# Altium schematic sheet MCU.SchDoc
size A4
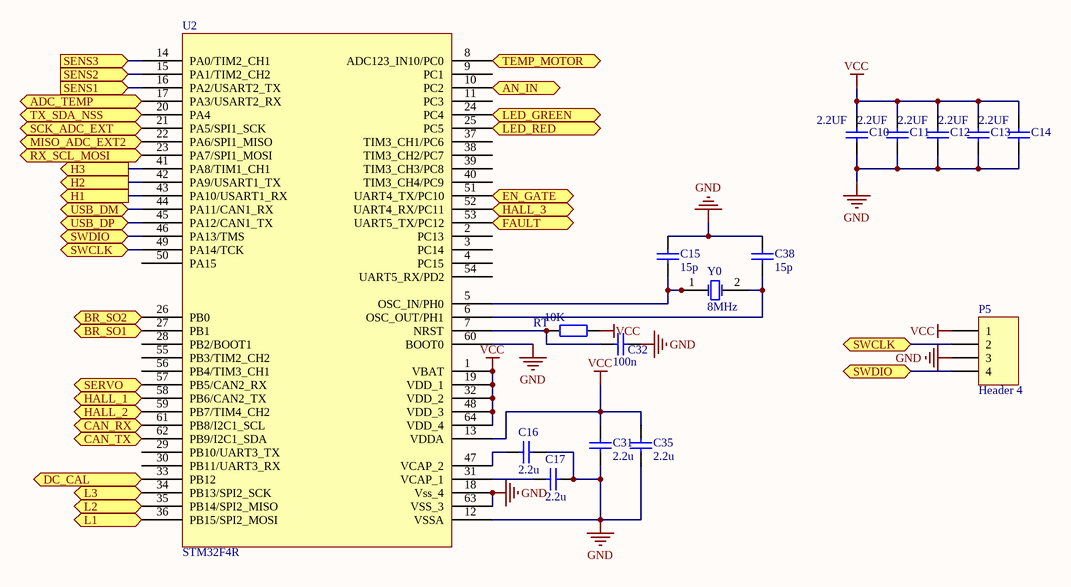
[diagram p0: MCU.SchDoc]

## Parts
C10  2.2UF  [C-0603]
C11  2.2UF  [C-0603]
C12  2.2UF  [C-0603]
C13  2.2UF  [C-0603]
C14  2.2UF  [C-0603]
C15  value 15p  [0402]  (hidden comment: 15PF)
C16  value 2.2u  [C-0603]  (hidden comment: 2.2UF)
C17  value 2.2u  [C-0603]  (hidden comment: 2.2UF)
C31  value 2.2u  [C-0603]  (hidden comment: 2.2UF)
C32  value 100n  [C-0603]  (hidden comment: 100NF)
C35  value 2.2u  [C-0603]  (hidden comment: 2.2UF)
C38  value 15p  [0402]  (hidden comment: 15PF)
P5  Header 4  [H-1X4]
RT  10K  [0603-2]
U2  STM32F4R  [STM32F4R]
Y0  8MHz  [XTAL_5032]

## Ports
ADC_TEMP, AN_IN (in), BR_SO1 (in), BR_SO2 (in), CAN_RX, CAN_TX, DC_CAL (in), EN_GATE (out), FAULT (in), H1 (out), H2 (out), H3 (out), HALL_1 (in), HALL_2 (in), HALL_3 (in), L1 (out), L2 (out), L3 (out), LED_GREEN (out), LED_RED (out), MISO_ADC_EXT2 (in), RX_SCL_MOSI (in), SCK_ADC_EXT (in), SENS1 (in), SENS2 (in), SENS3 (in), SERVO (out), SWCLK, SWDIO, TEMP_MOTOR (in), TX_SDA_NSS (in), USB_DM, USB_DP

## Nets
GND: C10.1 C11.1 C12.1 C13.1 C14.1 C15.2 C16.1 C17.1 C31.1 C32.1 C35.1 C38.2 P5.3 U2.12(VSSA) U2.18(Vss_4) U2.60(BOOT0) U2.63(VSS_3)
VCC: C10.2 C11.2 C12.2 C13.2 C14.2 C31.2 C35.2 P5.1 RT.2 U2.1(VBAT) U2.13(VDDA) U2.19(VDD_1) U2.32(VDD_2) U2.48(VDD_3) U2.64(VDD_4)
ADC_TEMP: U2.17(PA3/USART2_RX) ; port ADC_TEMP
AN_IN: U2.10(PC2) ; port AN_IN
BR_SO1: U2.27(PB1) ; port BR_SO1
BR_SO2: U2.26(PB0) ; port BR_SO2
CAN_RX: U2.61(PB8/I2C1_SCL) ; port CAN_RX
CAN_TX: U2.62(PB9/I2C1_SDA) ; port CAN_TX
DC_CAL: U2.33(PB12) ; port DC_CAL
EN_GATE: U2.51(UART4_TX/PC10) ; port EN_GATE
FAULT: U2.53(UART5_TX/PC12) ; port FAULT
H1: U2.43(PA10/USART1_RX) ; port H1
H2: U2.42(PA9/USART1_TX) ; port H2
H3: U2.41(PA8/TIM1_CH1) ; port H3
HALL_1: U2.58(PB6/CAN2_TX) ; port HALL_1
HALL_2: U2.59(PB7/TIM4_CH2) ; port HALL_2
HALL_3: U2.52(UART4_RX/PC11) ; port HALL_3
L1: U2.36(PB15/SPI2_MOSI) ; port L1
L2: U2.35(PB14/SPI2_MISO) ; port L2
L3: U2.34(PB13/SPI2_SCK) ; port L3
LED_GREEN: U2.24(PC4) ; port LED_GREEN
LED_RED: U2.25(PC5) ; port LED_RED
MISO_ADC_EXT2: U2.22(PA6/SPI1_MISO) ; port MISO_ADC_EXT2
RX_SCL_MOSI: U2.23(PA7/SPI1_MOSI) ; port RX_SCL_MOSI
SCK_ADC_EXT: U2.21(PA5/SPI1_SCK) ; port SCK_ADC_EXT
SENS1: U2.16(PA2/USART2_TX) ; port SENS1
SENS2: U2.15(PA1/TIM2_CH2) ; port SENS2
SENS3: U2.14(PA0/TIM2_CH1) ; port SENS3
SERVO: U2.57(PB5/CAN2_RX) ; port SERVO
SWCLK: P5.2 U2.49(PA14/TCK) ; port SWCLK
SWDIO: P5.4 U2.46(PA13/TMS) ; port SWDIO
TEMP_MOTOR: U2.8(ADC123_IN10/PC0) ; port TEMP_MOTOR
TX_SDA_NSS: U2.20(PA4) ; port TX_SDA_NSS
USB_DM: U2.44(PA11/CAN1_RX) ; port USB_DM
USB_DP: U2.45(PA12/CAN1_TX) ; port USB_DP
NetC15_1: C15.1 U2.5(OSC_IN/PH0) Y0.1(OSC1)
NetC16_2: C16.2 U2.47(VCAP_2)
NetC17_2: C17.2 U2.31(VCAP_1)
NetC32_2: C32.2 RT.1 U2.7(NRST)
NetC38_1: C38.1 U2.6(OSC_OUT/PH1) Y0.2(OSC2)

Not connected (* = marked no-connect by the designer): U2 2(PC13) 3(PC14) 4(PC15) 9(PC1) 11(PC3) 28(PB2/BOOT1) 29(PB10/UART3_TX) 30(PB11/UART3_RX) 37(TIM3_CH1/PC6) 38(TIM3_CH2/PC7) 39(TIM3_CH3/PC8) 40(TIM3_CH4/PC9) 50(PA15) 54(UART5_RX/PD2) 55(PB3/TIM2_CH2) 56(PB4/TIM3_CH1)

## Library data of the parts
C10-C14 = CAP: Capacitor; Value: 2.2u; Published: 8-Jun-2000; Revision: July-2002: Re-released for DXP Platform.; Publisher: Altium Limited
C15-C17 C31 C32 C35 C38 = CAP: Capacitor; Published: 8-Jun-2000; Revision: July-2002: Re-released for DXP Platform.; Publisher: Altium Limited
P5 = Header 4: Header, 4-Pin; LatestRevisionDate: 17-Jul-2002; LatestRevisionNote: Re-released for DXP Platform.; Publisher: Altium Limited
RT = Res1: 贴片电阻; Published: 8-Jun-2000; LatestRevisionDate: 17-Jul-2002; LatestRevisionNote: Re-released for DXP Platform.; PackageReference: AXIAL-0.4; Publisher: Altium Limited; Value: 10K
Y0 = XTAL: Crystal Oscillator; Published: 8-Jun-2000; LatestRevisionDate: 17-Jul-2002; LatestRevisionNote: Re-released for DXP Platform.; PackageReference: R38; Publisher: Altium Limited